# Altium schematic sheet PAPRE.SchDoc
size A4
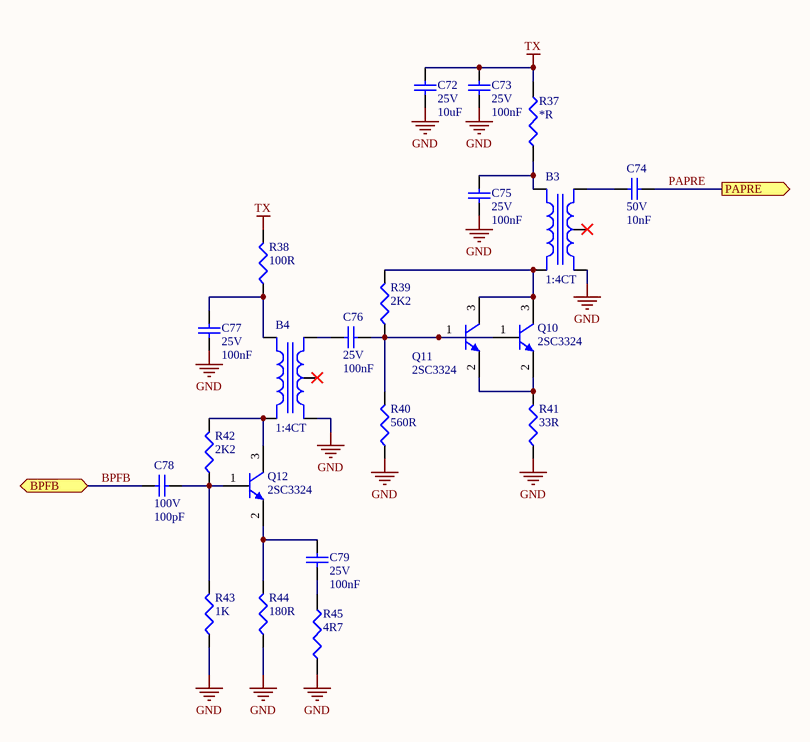
[diagram p0: PAPRE.SchDoc]

## Parts
B3  1:4CT  [CX2047LANL]
B4  1:4CT  [CX2047LANL]
C72  value 10uF  Tensão: 25V  [CC0805]  (hidden comment: Capacitor Cerâmico)
C73  value 100nF  Tensão: 25V  [CC0603]  (hidden comment: Capacitor Cerâmico)
C74  value 10nF  Tensão: 50V  [CC0603]  (hidden comment: Capacitor Cerâmico)
C75  value 100nF  Tensão: 25V  [CC0603]  (hidden comment: Capacitor Cerâmico)
C76  value 100nF  Tensão: 25V  [CC0603]  (hidden comment: Capacitor Cerâmico)
C77  value 100nF  Tensão: 25V  [CC0603]  (hidden comment: Capacitor Cerâmico)
C78  value 100pF  Tensão: 100V  [CC0603]  (hidden comment: Capacitor Cerâmico)
C79  value 100nF  Tensão: 25V  [CC0603]  (hidden comment: Capacitor Cerâmico)
Q10  2SC3324  [SOT-23-3N]
Q11  2SC3324  [SOT-23-3N]
Q12  2SC3324  [SOT-23-3N]
R37  value *R  [CC0603]  (hidden comment: Resistor)
R38  value 100R  [CC0603]  (hidden comment: Resistor)
R39  value 2K2  [CC0603]  (hidden comment: Resistor)
R40  value 560R  [CC0603]  (hidden comment: Resistor)
R41  value 33R  [CC0603]  (hidden comment: Resistor)
R42  value 2K2  [CC0603]  (hidden comment: Resistor)
R43  value 1K  [CC0603]  (hidden comment: Resistor)
R44  value 180R  [CC0603]  (hidden comment: Resistor)
R45  value 4R7  [CC0603]  (hidden comment: Resistor)

## Ports
BPFB (bidir), PAPRE (out)

## Nets
GND: B3.3(Pri-) B4.3(Pri-) C72.1 C73.2 C75.2 C77.1 R40.1 R41.1 R43.1 R44.1 R45.1
TX: C72.2 C73.1 R37.2 R38.2
BPFB: C78.1 ; port BPFB
PAPRE: C74.1 ; port PAPRE
NetB3_1: B3.1(Sec+) C74.2
NetB3_4: B3.4(Pri+) Q10.3(C) Q11.3(C) R39.2
NetB3_6: B3.6(Sec-) C75.1 R37.1
NetB4_1: B4.1(Sec+) C76.2
NetB4_4: B4.4(Pri+) Q12.3(C) R42.2
NetB4_6: B4.6(Sec-) C77.2 R38.1
NetC76_1: C76.1 Q10.1(B) Q11.1(B) R39.1 R40.2
NetC78_2: C78.2 Q12.1(B) R42.1 R43.2
NetC79_1: C79.1 R45.2
NetC79_2: C79.2 Q12.2(E) R44.2
NetQ10_2: Q10.2(E) Q11.2(E) R41.2

Not connected (* = marked no-connect by the designer): B3 2(Sec+)*; B4 2(Sec+)*

## Library data of the parts
B3 B4 = BALUN CX2047LANL: Balun 4CT:1; ChinesePrice: 0,00000; Chinês: ----; Corrente: *; Potência: *; Supplier 1: Digi-Key; Supplier Part Number 1: 553-2770-1-ND; Tensão: *; Obs:: *; Tolerância: *; ComponentLink1Description: Datasheet; ComponentLink1URL: D:\Tecnoclade\Datasheet\!DataMissing.pdf; Substituição: 00/00/0000; Value: *
C72 = Cap 10uF 25V 0805 X5R: Capacitor (Semiconductor SIM Model); Chinês: Local; ChinesePrice: 0,02620; Corrente: *A; Potência: *W; Obs:: X5R; Tolerância: ±10%; Supplier 1: Digi-Key; Supplier Part Number 1: 587-2985-1-ND; ComponentLink1Description: Datasheet; ComponentLink1URL: D:\Tecnoclade\Datasheet\!DataMissing.pdf
C73 C75-C77 C79 = Cap 100nF 25V 0603 X7R: Capacitor (Semiconductor SIM Model); Chinês: Local; ChinesePrice: 0,00246; Corrente: *A; Potência: *W; Obs:: X7R; Tolerância: ±10%; Supplier 1: Digi-Key; Supplier Part Number 1: 490-1524-1-ND; ComponentLink1Description: Datasheet; ComponentLink1URL: D:\Tecnoclade\Datasheet\!DataMissing.pdf
C74 = Cap 10nF 50V 0603 X7R 5%: Capacitor (Semiconductor SIM Model); Chinês: Local; ChinesePrice: 0,00320; Corrente: *A; Potência: *W; Obs:: X7R; Tolerância: ±5%; Supplier 1: Digi-Key; Supplier Part Number 1: 399-1092-1-ND; ComponentLink1Description: Datasheet; ComponentLink1URL: D:\Tecnoclade\Datasheet\!DataMissing.pdf
C78 = Cap 100pF 100V 0603 NP0: Capacitor (Semiconductor SIM Model); Chinês: -----; ChinesePrice: 0,00000; Corrente: *A; Potência: *W; Obs:: NP0; Tolerância: ±5%; Supplier 1: Digi-Key; Supplier Part Number 1: 1276-1295-1-ND; ComponentLink1Description: Datasheet; ComponentLink1URL: D:\Tecnoclade\Datasheet\!DataMissing.pdf
Q10-Q12 = TRS 2SC3324 120V 100mA SOT-23-3: NPN General Purpose Amplifier; Tensão: 40V; Corrente: 600mA; Potência: 350mW; Chinês: ----; ChinesePrice: 0,00000; Value: 300MHz; Supplier 1: Digi-Key; Supplier Part Number 1: 2SC3324-BL(TE85LFCT-ND; Obs:: *; Tolerância: *; ComponentLink1Description: Datasheet; ComponentLink1URL: D:\Tecnoclade\Datasheet\!DataMissing.pdf
R37 = Res - $Val $% $Footprint $Pot: ChinesePrice: 0,00000; Chinês: ----; Corrente: *A; Potência: 1/10W; Tensão: *V; Tolerância: ±*%; Supplier 1: Digi-Key; Supplier Part Number 1: --Del; Obs:: *; ComponentLink1Description: Datasheet; ComponentLink1URL: D:\Tecnoclade\Datasheet\!DataMissing.pdf
R38 = Res 100R 5% 0603 1/10W: ChinesePrice: 0,00080; Chinês: Local; Corrente: *A; Potência: 1/10W; Tensão: *V; Tolerância: ±5%; Supplier 1: Digi-Key; Supplier Part Number 1: RMCF0603JT100RCT-ND; Obs: *; ComponentLink1Description: Datasheet; ComponentLink1URL: D:\Tecnoclade\Datasheet\!DataMissing.pdf
R39 R42 = Res 2K2 5% 0603 1/10W: ChinesePrice: 0,00000; Chinês: ----; Corrente: *A; Potência: 1/10W; Tensão: *V; Obs: ±200ºC/ppm; Tolerância: ±5%; Supplier 1: Digi-Key; Supplier Part Number 1: RMCF0603JT2K20CT-ND; ComponentLink1Description: Datasheet; ComponentLink1URL: D:\Tecnoclade\Datasheet\!DataMissing.pdf
R40 = Res 560R 1% 0603 1/8W: ChinesePrice: 0,00000; Chinês: ----; Corrente: *A; Potência: 1/8W; Tensão: *V; Tolerância: ±1%; Supplier 1: Digi-Key; Supplier Part Number 1: MCT0603-560-CFCT-ND; Obs: *; ComponentLink1Description: Datasheet; ComponentLink1URL: D:\Tecnoclade\Datasheet\!DataMissing.pdf
R41 = Res 33R 1% 0603 1/10W: ChinesePrice: 0,00000; Chinês: ----; Corrente: *A; Potência: 1/10W; Tensão: *V; Obs: ±100ppm/ºC; Tolerância: ±1%; Supplier 1: Digi-Key; Supplier Part Number 1: P33.0HCT-ND; ComponentLink1Description: Datasheet; ComponentLink1URL: D:\Tecnoclade\Datasheet\!DataMissing.pdf
R43 = Res 1K 1% 0603 1/10W: ChinesePrice: 0,00089; Chinês: Local; Corrente: *A; Potência: 1/10W; Tensão: *V; Tolerância: ±1%; Supplier 1: Digi-Key; Supplier Part Number 1: RMCF0603FT1K00CT-ND; Obs: *; ComponentLink1Description: Datasheet; ComponentLink1URL: D:\Tecnoclade\Datasheet\!DataMissing.pdf
R44 = Res 180R 1% 0603 1/10W: ChinesePrice: 0,00000; Chinês: -----; Corrente: *A; Potência: 1/10W; Tensão: *V; Obs: ±100ppm/ºC; Tolerância: ±1%; Supplier 1: Digi-Key; Supplier Part Number 1: RMCF0603FT180RCT-ND; ComponentLink1Description: Datasheet; ComponentLink1URL: D:\Tecnoclade\Datasheet\!DataMissing.pdf
R45 = Res 4R7 1% 0603 1/10W: ChinesePrice: 0,00000; Chinês: ----; Corrente: *A; Potência: 1/10W; Tensão: *V; Tolerância: ±*%; Supplier 1: Digi-Key; Supplier Part Number 1: 311-4.7GRCT-ND; Obs:: *; ComponentLink1Description: Datasheet; ComponentLink1URL: D:\Tecnoclade\Datasheet\!DataMissing.pdf